# Altium schematic sheet 传感器.SchDoc
size A4
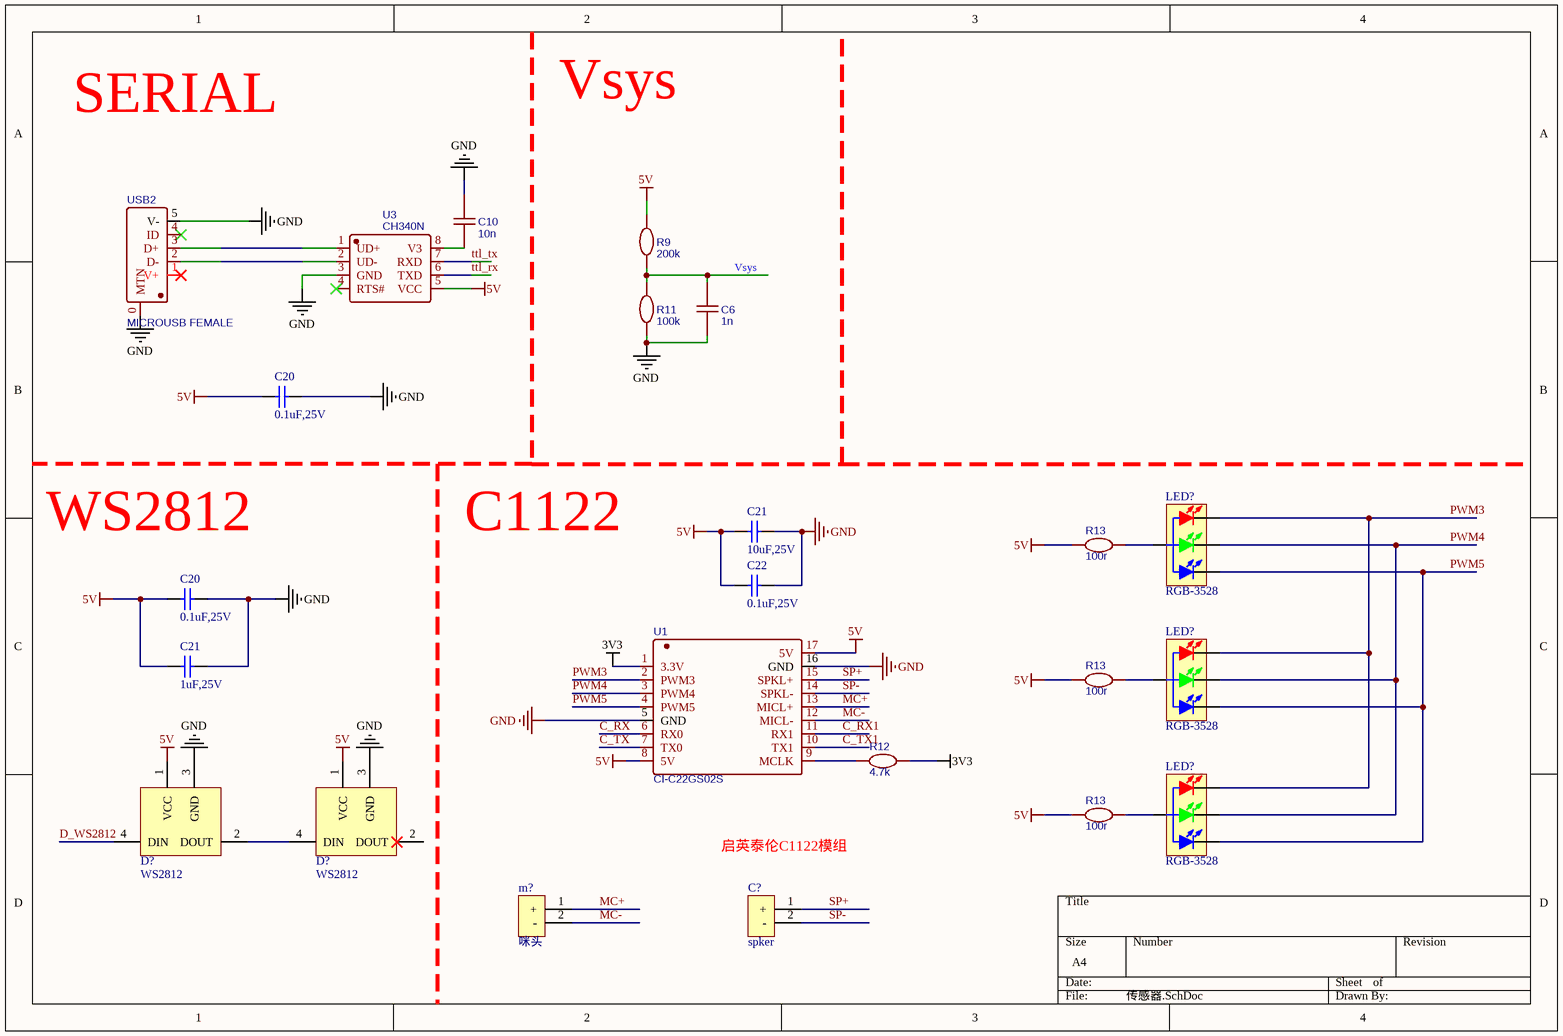
[diagram p0: 传感器.SchDoc]

## Parts
(Parts that share a designator on the sheet are numbered #1, #2 ... from top to bottom, then left to right.)
C6  1n  [C0603 NSK]
C10  10n  [C0603 NSK]
C20#1  value 0.1uF,25V  [0603_C]  (hidden comment: Cap)
C20#2  value 0.1uF,25V  [0603_C]  (hidden comment: Cap)
C21#1  value 10uF,25V  [0603_C]  (hidden comment: Cap)
C21#2  value 1uF,25V  [0603_C]  (hidden comment: Cap)
C22  value 0.1uF,25V  [0603_C]  (hidden comment: Cap)
C?  spker
D?#1  WS2812
D?#2  WS2812
LED?#1  RGB-3528  [LED 3528-4Pin]
LED?#2  RGB-3528  [LED 3528-4Pin]
LED?#3  RGB-3528  [LED 3528-4Pin]
m?  咪头
R9  200k  [R0603 NSK]
R11  100k  [R0603 NSK]
R12  4.7k  [R0603 NSK]
R13#1  100r  [R0603 NSK]
R13#2  100r  [R0603 NSK]
R13#3  100r  [R0603 NSK]
U1  CI-C22GS02S  [SMD-17_L20.0-W1.80-CI-C22GS02S]
U3  CH340N  [SOP-8_L5.0-W4.0-P1.27-LS6.0-BL]
USB2  MICROUSB FEMALE  [MICRO-USB-SMD_5P-P0.65-H-F_C10418]

## Nets
3V3: R12.1 U1.1(3.3V)
5V: C20#1.2 C20#2.2 C21#1.1 C21#2.2 C22.1 D?#1.1(VCC) D?#2.1(VCC) R9.2 R13#1.2 R13#2.2 R13#3.2 U1.8(5V) U1.17(5V) U3.5(VCC)
GND: C6.1 C10.2 C20#1.1 C20#2.1 C21#1.2 C21#2.1 C22.2 D?#1.3(GND) D?#2.3(GND) R11.1 U1.5(GND) U1.16(GND) U3.3(GND) USB2.0(MTN) USB2.5(V-)
C_RX: U1.6(RX0)
C_RX1: U1.11(RX1)
C_TX: U1.7(TX0)
C_TX1: U1.10(TX1)
D_WS2812: D?#1.4(DIN)
MC+: m?.1(+) U1.13(MICL+)
MC-: m?.2(-) U1.12(MICL-)
PWM3: LED?#1.1(RED_K) LED?#2.1(RED_K) LED?#3.1(RED_K) U1.2(PWM3)
PWM4: LED?#1.3(GREEN_K) LED?#2.3(GREEN_K) LED?#3.3(GREEN_K) U1.3(PWM4)
PWM5: LED?#1.4(BULE_K) LED?#2.4(BULE_K) LED?#3.4(BULE_K) U1.4(PWM5)
SP+: C?.1(+) U1.15(SPKL+)
SP-: C?.2(-) U1.14(SPKL-)
ttl_rx: U3.6(TXD)
ttl_tx: U3.7(RXD)
Vsys: C6.2 R9.1 R11.2
NetC10_1: C10.1 U3.8(V3)
NetD?#1_2: D?#1.2(DOUT) D?#2.4(DIN)
NetLED?#1_2: LED?#1.2(A) R13#1.1
NetLED?#2_2: LED?#2.2(A) R13#2.1
NetLED?#3_2: LED?#3.2(A) R13#3.1
NetR12_2: R12.2 U1.9(MCLK)
NetU3_1: U3.1(UD+) USB2.3(D+)
NetU3_2: U3.2(UD-) USB2.2(D-)

Not connected (* = marked no-connect by the designer): D?#2 2(DOUT); U3 4(RTS#)*; USB2 1(V+)* 4(ID)*

## Notes on the sheet
- Vsys
- SERIAL
- WS2812
- C1122
- 启英泰伦C1122模组

## Library data of the parts
C6 = 1n: nameAlias: Value(F); Contributor: LCEDA_Lib; spicePre: C; spiceSymbolName: C_0603_US
C10 = 10n: nameAlias: Value(F); Contributor: LCEDA_Lib; spicePre: C; spiceSymbolName: C_0603_US
C20#1 C20#2 C21#1 C21#2 C22 = T_Cap_0603_0.1uF_25V_X5R: 贴片电容; Part Typer: X5R; Solder: SMD; Withstand Voltage: 25V; Tolerance: 10%; Schematic Path: X:\Database\Schematic Library.Schlib; Part Number: T_Cap_0603_0.1uF_25V_X5R; LibRef: T_Cap_0603_0.1uF_25V_X5R
C? = SPK
LED?#1-LED?#3 = LED-RGB-3528: 三基色LED; 版权归属: 源创客; BOM名称: 三基色LED; 学习资源: www.ooocke.com
m? = mic
R9 = 200k: nameAlias: Value(Ω); Contributor: LCEDA_Lib; spicePre: R; spiceSymbolName: R_0603_EU
R11 R12 R13#1-R13#3 = 100k: nameAlias: Value(Ω); Contributor: LCEDA_Lib; spicePre: R; spiceSymbolName: R_0603_EU
U1 = CI-C22GS02S: BOM_Manufacturer: Chiplntelli(启英泰伦); Contributor: LCSC; BOM_Supplier: LCSC; BOM_Supplier Part: C2759836; BOM_Manufacturer Part: CI-C22GS02S; BOM_JLCPCB Part Class: Extended Part; spicePre: U; spiceSymbolName: CI-C22GS02S
U3 = CH340N: BOM_Manufacturer: WCH(Jiangsu Qin Heng); Contributor: LCSC; BOM_Supplier: LCSC; BOM_Supplier Part: C506813; BOM_Manufacturer Part: CH340N; BOM_JLCPCB Part Class: Extended Part; spicePre: U; spiceSymbolName: CH340N
USB2 = MICROUSB FEMALE: BOM_Manufacturer: ValuePro; BOM_Supplier: LCSC; BOM_Manufacturer Part: micro USBFemale; BOM_Supplier Part: C10418; BOM_JLCPCB Part Class: Extended Part; spicePre: U; spiceSymbolName: MICROUSB FEMALE